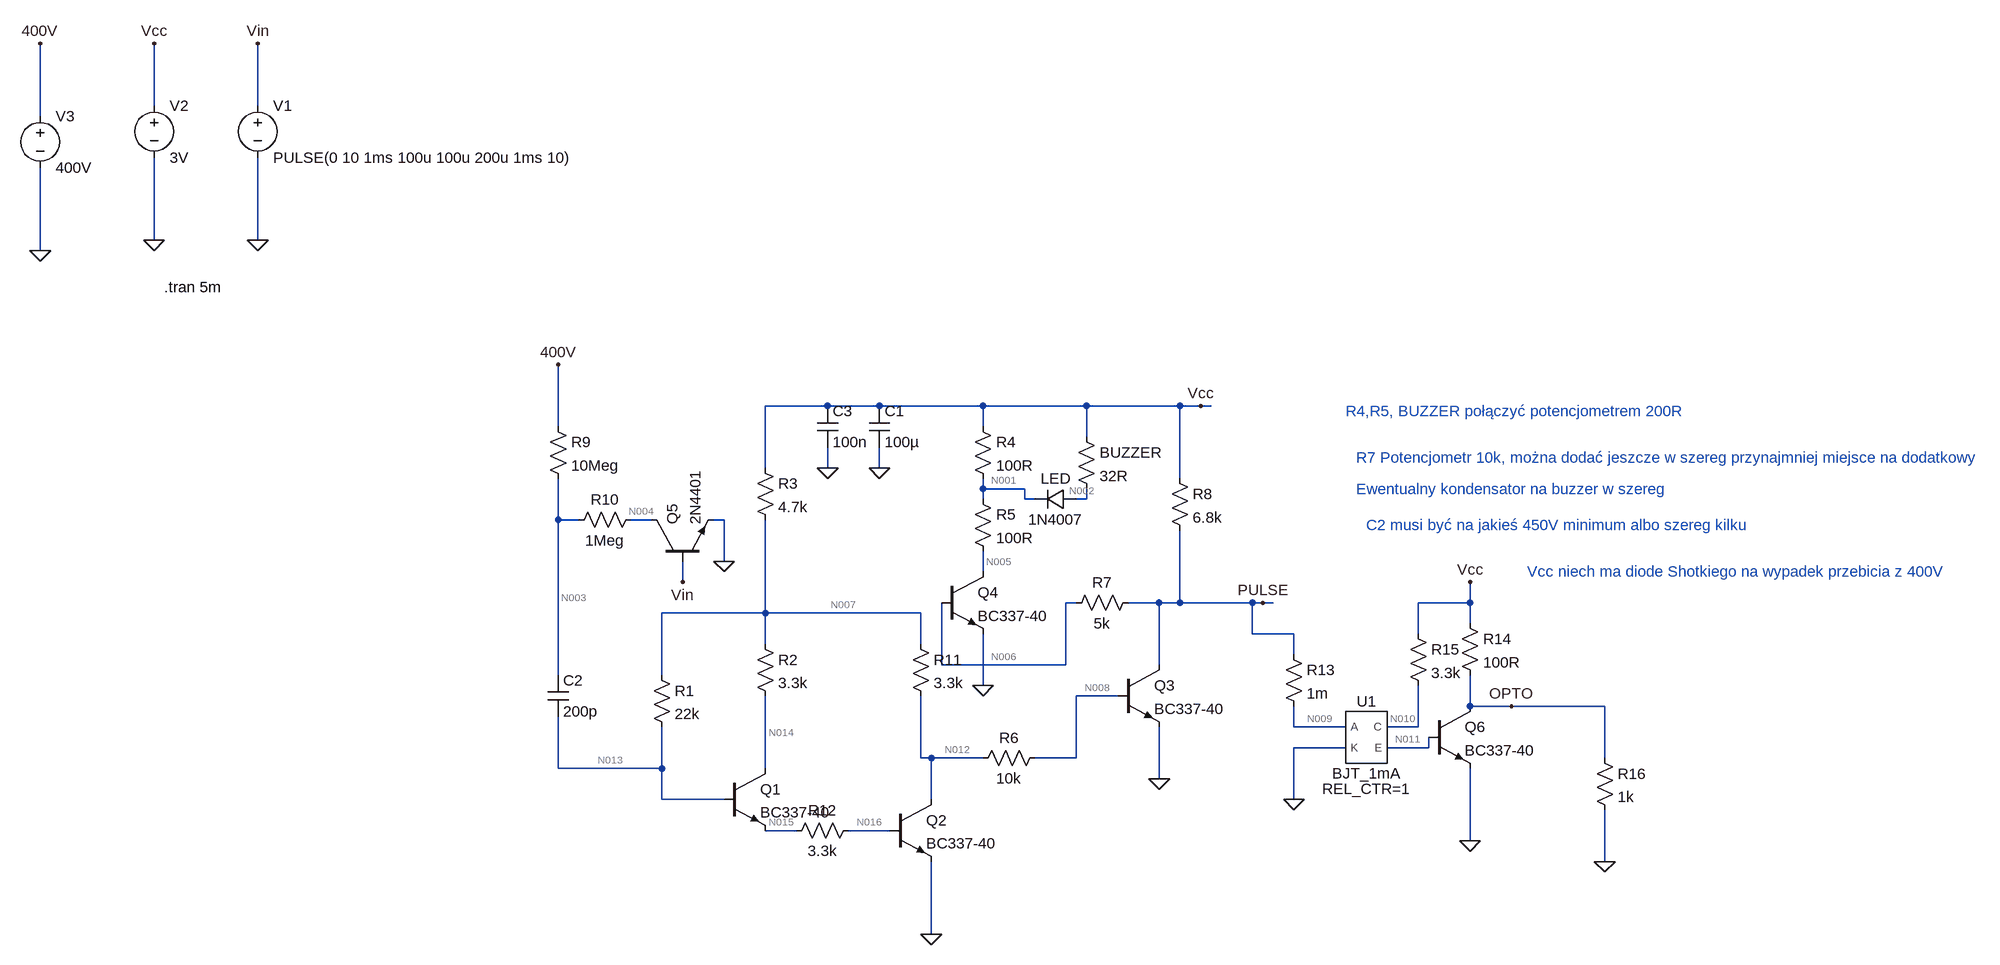
[diagram p0: schematic Driver lampy.asc]
Driver lampy.asc, the LTspice schematic file:
Version 4
SHEET 1 2304 884
WIRE -592 -416 -592 -512
WIRE -432 -416 -432 -512
WIRE -768 -400 -768 -512
WIRE -592 -208 -592 -336
WIRE -432 -208 -432 -336
WIRE -768 -192 -768 -320
WIRE 448 48 352 48
WIRE 528 48 448 48
WIRE 688 48 528 48
WIRE 848 48 688 48
WIRE 992 48 848 48
WIRE 1024 48 992 48
WIRE 1040 48 1024 48
WIRE 32 80 32 -16
WIRE 688 80 688 48
WIRE 848 96 848 48
WIRE 352 144 352 48
WIRE 448 144 448 112
WIRE 528 144 528 112
WIRE 992 160 992 48
WIRE 688 176 688 160
WIRE 752 176 688 176
WIRE 688 192 688 176
WIRE 752 192 752 176
WIRE 768 192 752 192
WIRE 848 192 848 176
WIRE 848 192 832 192
WIRE 32 224 32 160
WIRE 64 224 32 224
WIRE 176 224 144 224
WIRE 288 224 272 224
WIRE 288 288 288 224
WIRE 688 304 688 272
WIRE 224 320 224 288
WIRE 832 352 816 352
WIRE 960 352 912 352
WIRE 992 352 992 240
WIRE 992 352 960 352
WIRE 1104 352 992 352
WIRE 1120 352 1104 352
WIRE 1136 352 1120 352
WIRE 1440 352 1440 320
WIRE 1440 352 1360 352
WIRE 352 368 352 224
WIRE 352 368 192 368
WIRE 592 368 352 368
WIRE 1440 384 1440 352
WIRE 1104 400 1104 352
WIRE 1168 400 1104 400
WIRE 1360 400 1360 352
WIRE 352 416 352 368
WIRE 592 416 592 368
WIRE 1168 432 1168 400
WIRE 624 448 624 352
WIRE 816 448 816 352
WIRE 816 448 624 448
WIRE 960 448 960 352
WIRE 32 464 32 224
WIRE 192 464 192 368
WIRE 688 480 688 400
WIRE 896 496 832 496
WIRE 1440 512 1440 464
WIRE 1504 512 1440 512
WIRE 1648 512 1504 512
WIRE 1168 544 1168 512
WIRE 1248 544 1168 544
WIRE 1360 544 1360 480
WIRE 1360 544 1312 544
WIRE 1248 576 1168 576
WIRE 1376 576 1376 560
WIRE 1376 576 1312 576
WIRE 592 592 592 496
WIRE 608 592 592 592
WIRE 688 592 608 592
WIRE 832 592 832 496
WIRE 832 592 768 592
WIRE 1648 592 1648 512
WIRE 32 608 32 528
WIRE 192 608 192 544
WIRE 192 608 32 608
WIRE 352 608 352 496
WIRE 960 624 960 544
WIRE 192 656 192 608
WIRE 288 656 192 656
WIRE 608 656 608 592
WIRE 1168 656 1168 576
WIRE 400 704 352 704
WIRE 544 704 480 704
WIRE 1440 720 1440 608
WIRE 1648 752 1648 672
WIRE 608 864 608 752
FLAG -592 -512 Vcc
FLAG 224 320 Vin
FLAG -432 -208 0
FLAG -592 -208 0
FLAG -432 -512 Vin
FLAG 688 480 0
FLAG 960 624 0
FLAG 608 864 0
FLAG 1120 352 PULSE
FLAG 288 288 0
FLAG 32 -16 400V
FLAG -768 -512 400V
FLAG -768 -192 0
FLAG 1024 48 Vcc
FLAG 528 144 0
FLAG 448 144 0
FLAG 1168 656 0
FLAG 1440 720 0
FLAG 1440 320 Vcc
FLAG 1504 512 OPTO
FLAG 1648 752 0
SYMBOL voltage -432 -432 R0
WINDOW 123 0 0 Left 0
WINDOW 39 0 0 Left 0
SYMATTR InstName V1
SYMATTR Value PULSE(0 10 1ms 100u 100u 200u 1ms 10)
SYMBOL voltage -592 -432 R0
WINDOW 123 0 0 Left 0
WINDOW 39 0 0 Left 0
SYMATTR InstName V2
SYMATTR Value 3V
SYMBOL npn 544 656 R0
SYMATTR InstName Q2
SYMATTR Value BC337-40
SYMBOL npn 896 448 R0
SYMATTR InstName Q3
SYMATTR Value BC337-40
SYMBOL npn 624 304 R0
SYMATTR InstName Q4
SYMATTR Value BC337-40
SYMBOL res 176 448 R0
SYMATTR InstName R1
SYMATTR Value 22k
SYMBOL res 336 400 R0
SYMATTR InstName R2
SYMATTR Value 3.3k
SYMBOL res 672 64 R0
SYMATTR InstName R4
SYMATTR Value 100R
SYMBOL res 784 576 R90
WINDOW 0 0 56 VBottom 2
WINDOW 3 32 56 VTop 2
SYMATTR InstName R6
SYMATTR Value 10k
SYMBOL res 976 144 R0
SYMATTR InstName R8
SYMATTR Value 6.8k
SYMBOL cap 16 464 R0
SYMATTR InstName C2
SYMATTR Value 200p
SYMBOL res 16 64 R0
SYMATTR InstName R9
SYMATTR Value 10Meg
SYMBOL res 160 208 R90
WINDOW 0 0 56 VBottom 2
WINDOW 3 32 56 VTop 2
SYMATTR InstName R10
SYMATTR Value 1Meg
SYMBOL npn 176 288 R270
SYMATTR InstName Q5
SYMATTR Value 2N4401
SYMBOL voltage -768 -416 R0
WINDOW 123 0 0 Left 0
WINDOW 39 0 0 Left 0
SYMATTR InstName V3
SYMATTR Value 400V
SYMBOL npn 288 608 R0
SYMATTR InstName Q1
SYMATTR Value BC337-40
SYMBOL res 336 128 R0
SYMATTR InstName R3
SYMATTR Value 4.7k
SYMBOL res 928 336 R90
WINDOW 0 0 56 VBottom 2
WINDOW 3 32 56 VTop 2
SYMATTR InstName R7
SYMATTR Value 5k
SYMBOL res 576 400 R0
SYMATTR InstName R11
SYMATTR Value 3.3k
SYMBOL res 496 688 R90
WINDOW 0 0 56 VBottom 2
WINDOW 3 32 56 VTop 2
SYMATTR InstName R12
SYMATTR Value 3.3k
SYMBOL cap 512 48 R0
SYMATTR InstName C1
SYMATTR Value 100µ
SYMBOL res 832 80 R0
SYMATTR InstName BUZZER
SYMATTR Value 32R
SYMBOL cap 432 48 R0
SYMATTR InstName C3
SYMATTR Value 100n
SYMBOL res 672 176 R0
SYMATTR InstName R5
SYMATTR Value 100R
SYMBOL VOM618A 1280 560 R0
SYMATTR InstName U1
SYMBOL res 1424 368 R0
SYMATTR InstName R14
SYMATTR Value 100R
SYMBOL res 1152 416 R0
SYMATTR InstName R13
SYMATTR Value 1m
SYMBOL npn 1376 512 R0
SYMATTR InstName Q6
SYMATTR Value BC337-40
SYMBOL res 1344 384 R0
SYMATTR InstName R15
SYMATTR Value 3.3k
SYMBOL res 1632 576 R0
SYMATTR InstName R16
SYMATTR Value 1k
SYMBOL diode 832 176 R90
WINDOW 0 0 32 VBottom 2
WINDOW 3 32 32 VTop 2
SYMATTR InstName LED
SYMATTR Value 1N4007
TEXT -576 -136 Left 2 !.tran 5m
TEXT 1248 56 Left 2 ;R4,R5, BUZZER połączyć potencjometrem 200R
TEXT 1264 128 Left 2 ;R7 Potencjometr 10k, można dodać jeszcze w szereg przynajmniej miejsce na dodatkowy
TEXT 1264 176 Left 2 ;Ewentualny kondensator na buzzer w szereg
TEXT 1280 232 Left 2 ;C2 musi być na jakieś 450V minimum albo szereg kilku
TEXT 1528 304 Left 2 ;Vcc niech ma diode Shotkiego na wypadek przebicia z 400V

The netlist it stands for:
* Driver lampy.asc
V1 Vin 0 PULSE(0 10 1ms 100u 100u 200u 1ms 10)
V2 Vcc 0 3V
Q2 N012 N016 0 0 BC337-40
Q3 PULSE N008 0 0 BC337-40
Q4 N005 N006 0 0 BC337-40
R1 N007 N013 22k
R2 N007 N014 3.3k
R4 Vcc N001 100R
R6 N008 N012 10k
R8 Vcc PULSE 6.8k
C2 N003 N013 200p
R9 400V N003 10Meg
R10 N004 N003 1Meg
Q5 N004 Vin 0 0 2N4401
V3 400V 0 400V
Q1 N014 N013 N015 0 BC337-40
R3 Vcc N007 4.7k
R7 PULSE N006 5k
R11 N007 N012 3.3k
R12 N016 N015 3.3k
C1 Vcc 0 100µ
R§BUZZER Vcc N002 32R
C3 Vcc 0 100n
R5 N001 N005 100R
XU1 N009 0 N010 N011 BJT_1mA REL_CTR=1  ; pins A K C E
R14 Vcc OPTO 100R
R13 PULSE N009 1m
Q6 OPTO N011 0 0 BC337-40
R15 Vcc N010 3.3k
R16 OPTO 0 1k
D§LED N002 N001 1N4007
.model D D
.lib standard.dio
.model NPN NPN
.model PNP PNP
.lib standard.bjt
.tran 5m
* R4,R5, BUZZER połączyć potencjometrem 200R
* R7 Potencjometr 10k, można dodać jeszcze w szereg przynajmniej miejsce na dodatkowy
* Ewentualny kondensator na buzzer w szereg
* C2 musi być na jakieś 450V minimum albo szereg kilku
* Vcc niech ma diode Shotkiego na wypadek przebicia z 400V
.lib C:\Users\wojte\Desktop\Projekty\Dozymetr\Spice Model_BJT_1mA\BJT_1mA.lib
.backanno
.end

* Results of the author's LTspice run, read from the files saved beside the schematic
* Operating Point, zero values left out:
*   V(vcc) = 3 V
*   V(n012) = 13.26 mV
*   V(n016) = 599.3 mV
*   V(pulse) = 972.5 mV
*   V(n008) = 13.26 mV
*   V(n005) = 121.5 mV
*   V(n006) = 680.3 mV
*   V(n007) = 1.194 V
*   V(n013) = 1.192 V
*   V(n014) = 1.106 V
*   V(n001) = 2.03 V
*   V(n003) = 400 V
*   V(400v) = 400 V
*   V(n004) = 400 V
*   V(n015) = 687.3 mV
*   V(n002) = 2.699 V
*   V(n009) = 972.5 mV
*   V(n010) = 2.64 V
*   V(n011) = 695 mV
*   V(opto) = 103.6 mV
*   Ic(Q2) = 357.7 µA
*   Ib(Q2) = 26.67 µA
*   Ie(Q2) = -384.3 µA
*   Ic(Q3) = 1.159 pA
*   Ib(Q3) = -1.013 pA
*   Ic(Q4) = 19.09 mA
*   Ib(Q4) = 58.44 µA
*   Ie(Q4) = -19.15 mA
*   Ic(Q1) = 26.6 µA
*   Ib(Q1) = 65.58 nA
*   Ie(Q1) = -26.67 µA
*   Ic(Q6) = 28.86 mA
*   Ib(Q6) = 109.1 µA
*   Ie(Q6) = -28.97 mA
*   Ic(Q5) = 400.1 pA
*   Ib(Q5) = -400 pA
*   I(Led) = 9.394 mA
*   I(R1) = 65.58 nA
*   I(R2) = 26.6 µA
*   I(R4) = 9.696 mA
*   I(R6) = 1.013 pA
*   I(R8) = 298.2 µA
*   I(R9) = 400.1 pA
*   I(R10) = -400.1 pA
*   I(R3) = 384.3 µA
*   I(R7) = 58.44 µA
*   I(R11) = 357.7 µA
*   I(R12) = -26.67 µA
*   I(Buzzer) = 9.394 mA
*   I(R5) = 19.09 mA
*   I(R14) = 28.96 mA
*   I(R13) = 239.7 µA
*   I(R15) = 109.2 µA
*   I(R16) = 103.6 µA
*   I(V1) = 400 pA
*   I(V2) = -48.85 mA
*   I(V3) = -400.1 pA
*   Ix(u1:A) = 239.7 µA
*   Ix(u1:K) = -239.7 µA
*   Ix(u1:C) = 109.2 µA
*   Ix(u1:E) = -109.2 µA
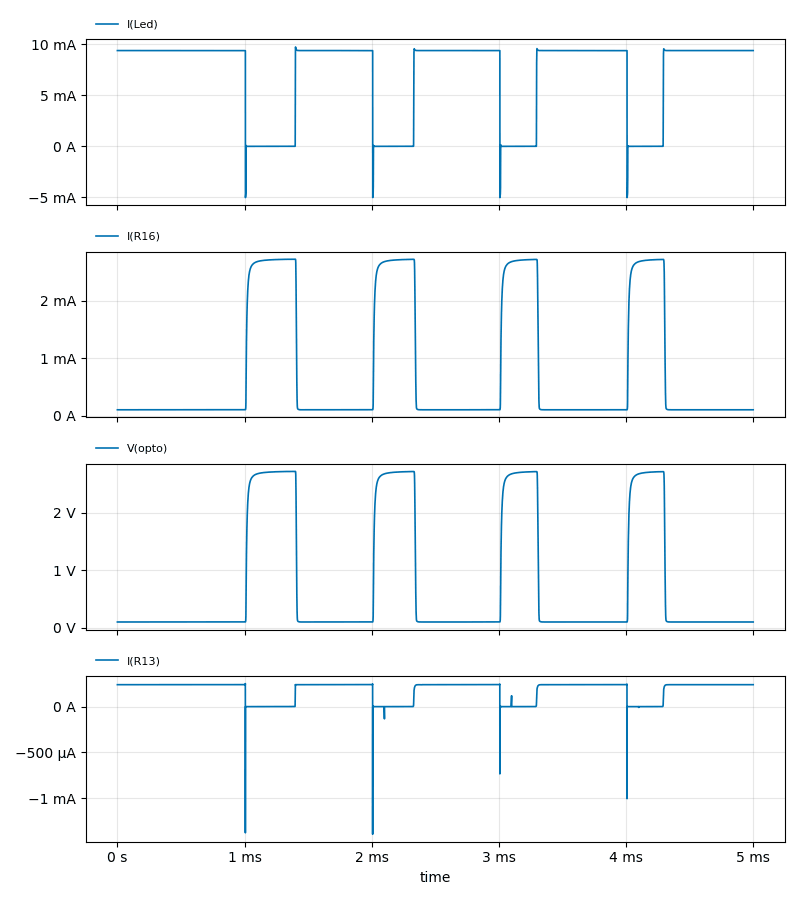
[diagram p1: Transient Analysis of Driver lampy.asc, plotted from the saved traces]
* Transient Analysis, 1 run:
*   I(Led): min -5.026 mA, max 9.746 mA, average 6.955 mA, rms 8.099 mA, last 9.394 mA
*   I(R16): min 103.5 µA, max 2.718 mA, average 768.5 µA, rms 1.354 mA, last 103.6 µA
*   V(opto): min 103.5 mV, max 2.718 V, average 768.5 mV, rms 1.354 V, last 103.6 mV
*   I(R13): min -1.394 mA, max 251.8 µA, average 177.6 µA, rms 206.4 µA, last 239.7 µA